# Altium project DSPpanel_v2.PrjPcb
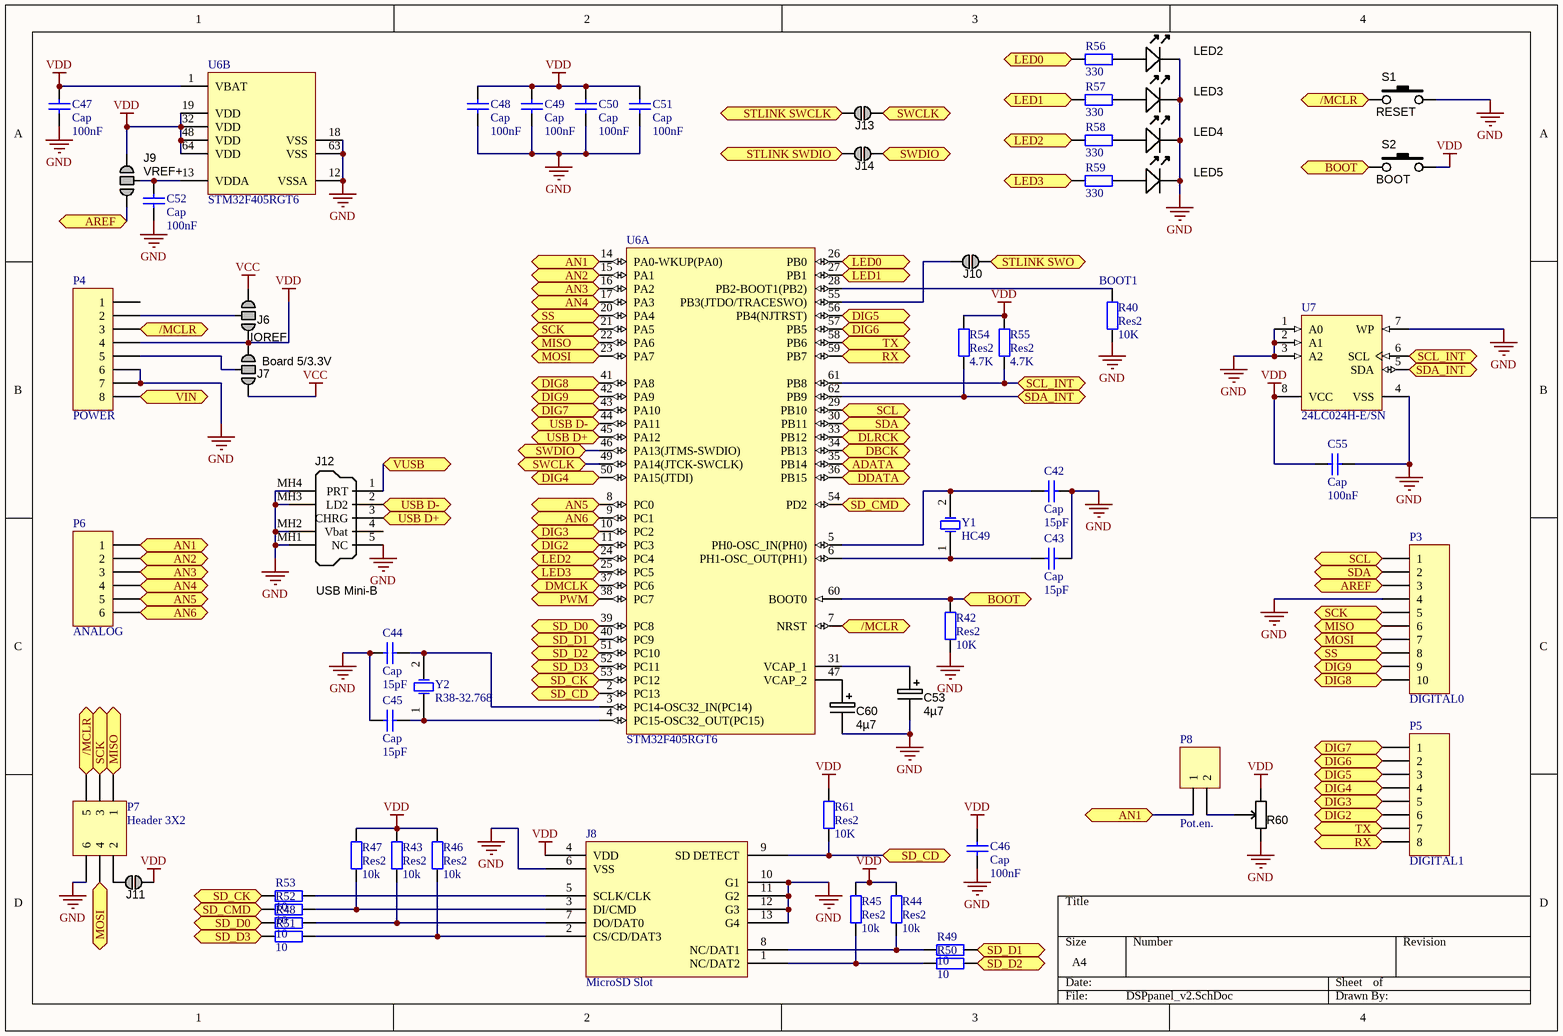
[diagram p0: DSPpanel_v2.SchDoc]
4 sheets, 189 parts. Net scope: flat (ports and power ports of the same name join across sheets).
Board files: DSPpanel_v2.PcbDoc, semlogo.PcbDoc
Sheets:
  DSPpanel_v2.SchDoc
  audioCodec.SchDoc
  tapegyseg.SchDoc
  stlink.SchDoc

## Sheet DSPpanel_v2.SchDoc
size A4

### Parts
C42  Cap  value 15pF  [CAPC2012X135N]
C43  Cap  value 15pF  [CAPC2012X135N]
C44  Cap  value 15pF  [CAPC2012X135N]
C45  Cap  value 15pF  [CAPC2012X135N]
C46  Cap  value 100nF  [CAPC2012X135N]
C47  Cap  value 100nF  [CAPC2012X135N]
C48  Cap  value 100nF  [CAPC2012X135N]
C49  Cap  value 100nF  [CAPC2012X135N]
C50  Cap  value 100nF  [CAPC2012X135N]
C51  Cap  value 100nF  [CAPC2012X135N]
C52  Cap  value 100nF  [CAPC2012X135N]
C53  4µ7  [CAPMP3216X180N]
C55  Cap  value 100nF  [CAPC2012X135N]
C60  4µ7  [CAPMP3216X180N]
J6  IOREF  [Jump_3Way]  (no BOM)
J7  Board 5/3.3V  [Jump_3Way]  (no BOM)
J8  MicroSD Slot  [MICROSD Slot]
J9  VREF+  [Jump_3Way]  (no BOM)
J10  Jumper  [JUMP1]  (value not drawn)  (no BOM)
J11  Jumper  [JUMP1]  (value not drawn)  (no BOM)
J12  USB Mini-B  [USB_Mini-B_Molex_SMT]
J13  Jumper  [JUMP1]  (value not drawn)  (no BOM)
J14  Jumper  [JUMP1]  (value not drawn)  (no BOM)
LED2  B0  [LED-0805-K]  (value not drawn)
LED3  B1  [LED-0805-K]  (value not drawn)
LED4  C4  [LED-0805-K]  (value not drawn)
LED5  C5  [LED-0805-K]  (value not drawn)
P3  DIGITAL0  [HDR1X10]
P4  POWER  [HDR1X8]
P5  DIGITAL1  [HDR1X8]
P6  ANALOG  [HDR1X6]
P7  Header 3X2  [HDR2X3]
P8  Pot.en.  [HDR1X2]
R40  Res2  value 10K  [RESC2012X70N]
R42  Res2  value 10K  [RESC2012X70N]
R43  Res2  value 10k  [RESC2012X70N]
R44  Res2  value 10k  [RESC2012X70N]
R45  Res2  value 10k  [RESC2012X70N]
R46  Res2  value 10k  [RESC2012X70N]
R47  Res2  value 10k  [RESC2012X70N]
R48  value 10  [RESC2012X70N]  (hidden comment: Res2)
R49  value 10  [RESC2012X70N]  (hidden comment: Res2)
R50  value 10  [RESC2012X70N]  (hidden comment: Res2)
R51  value 10  [RESC2012X70N]  (hidden comment: Res2)
R52  value 10  [RESC2012X70N]  (hidden comment: Res2)
R53  value 10  [RESC2012X70N]  (hidden comment: Res2)
R54  Res2  value 4.7K  [RESC2012X70N]
R55  Res2  value 4.7K  [RESC2012X70N]
R56  value 330  [RESC2012X70N]  (hidden comment: Res2)
R57  value 330  [RESC2012X70N]  (hidden comment: Res2)
R58  value 330  [RESC2012X70N]  (hidden comment: Res2)
R59  value 330  [RESC2012X70N]  (hidden comment: Res2)
R60  25 turns  [PT-105]  (value not drawn)
R61  Res2  value 10K  [RESC2012X70N]
S1  RESET  [TACT6x3]
S2  BOOT  [TACT6x3]
U6  STM32F405RGT6  [STM-LQFP64_M]  (parts A,B of 2)
U7  24LC024H-E/SN  [SOIC-SN8_M]
Y1  HC49  [HC49/4H_SMX]
Y2  R38-32.768  [R38]

### Ports
/MCLR, ADATA (out), AN1, AN2, AN3, AN4, AN5, AN6, AREF, BOOT, DBCK (bidir), DDATA (in), DIG2, DIG3, DIG4, DIG5, DIG6, DIG7, DIG8, DIG9, DLRCK (bidir), DMCLK (bidir), LED0, LED1, LED2, LED3, MISO, MOSI, PWM, RX, SCK, SCL, SCL_INT (bidir), SD_CD, SD_CK, SD_CMD, SD_D0, SD_D1, SD_D2, SD_D3, SDA, SDA_INT (bidir), SS, STLINK SWCLK (bidir), STLINK SWDIO (bidir), STLINK SWO (bidir), SWCLK (bidir), SWDIO (bidir), TX, USB D+ (bidir), USB D- (bidir), VIN, VUSB

### Nets
GND: C42.2 C43.2 C44.1 C45.1 C46.1 C47.1 C48.1 C49.1 C50.1 C51.1 C52.1 C53.2 C55.1 C60.2 J8.6(VSS) J8.10(G1) J8.11(G2) J8.12(G3) J8.13(G4) J12.5(NC) J12.MH1(Shell) J12.MH2(Shell) J12.MH3(Shell) J12.MH4(Shell) LED2.K LED3.K LED4.K LED5.K P3.4 P4.6 P4.7 P7.6 R40.1 R42.1 R60.3 S1.2 U6.12(VSSA) U6.18(VSS) U6.63(VSS) U7.1(A0) U7.2(A1) U7.3(A2) U7.4(VSS) U7.7(WP)
VCC: J6.1 J7.3
VDD: C46.2 C47.2 C48.2 C49.2 C50.2 C51.2 C55.2 J6.3 J7.1 J8.4(VDD) J9.3 J11.1 P4.4 R43.2 R44.2 R45.2 R46.2 R47.2 R54.2 R55.2 R60.1 R61.2 S2.2 U6.1(VBAT) U6.19(VDD) U6.32(VDD) U6.48(VDD) U6.64(VDD) U7.8(VCC)
NetC36_1: P4.8 ; port VIN
NetC42_1: C42.1 U6.5(PH0-OSC_IN(PH0)) Y1.2(OSC2)
NetC43_1: C43.1 U6.6(PH1-OSC_OUT(PH1)) Y1.1(OSC1)
NetC44_2: C44.2 U6.3(PC14-OSC32_IN(PC14)) Y2.2(OSC2)
NetC45_2: C45.2 U6.4(PC15-OSC32_OUT(PC15)) Y2.1(OSC1)
NetC52_2: C52.2 J9.2 U6.13(VDDA)
NetC53_1: C53.1 U6.31(VCAP_1)
NetC60_1: C60.1 U6.47(VCAP_2)
NetD1_A: U6.38(PC7) ; port PWM
NetF1_1: J12.1(PRT) ; port VUSB
NetJ6_2: J6.2 P4.2
NetJ7_2: J7.2 P4.5
NetJ8_1: J8.1(NC/DAT2) R45.1 R50.1
NetJ8_2: J8.2(CS/CD/DAT3) R46.1 R51.1
NetJ8_3: J8.3(DI/CMD) R47.1 R52.1
NetJ8_5: J8.5(SCLK/CLK) R53.1
NetJ8_7: J8.7(DO/DAT0) R43.1 R48.1
NetJ8_8: J8.8(NC/DAT1) R44.1 R49.1
NetJ8_9: J8.9(SD_DETECT) R61.1 U6.2(PC13) ; port SD_CD
NetJ9_1: J9.1 P3.3 ; port AREF
NetJ10_1: J10.1 ; port STLINK SWO
NetJ10_2: J10.2 U6.55(PB3(JTDO/TRACESWO))
NetJ11_2: J11.2 P7.2
NetJ12_2: J12.2(LD2) U6.44(PA11) ; port USB D-
NetJ12_3: J12.3(CHRG) U6.45(PA12) ; port USB D+
NetJ13_1: J13.1 U6.49(PA14(JTCK-SWCLK)) ; port SWCLK
NetJ13_2: J13.2 ; port STLINK SWCLK
NetJ14_1: J14.1 U6.46(PA13(JTMS-SWDIO)) ; port SWDIO
NetJ14_2: J14.2 ; port STLINK SWDIO
NetLED2_A: LED2.A R56.1
NetLED3_A: LED3.A R57.1
NetLED4_A: LED4.A R58.1
NetLED5_A: LED5.A R59.1
NetP3_1: P3.1 U6.29(PB10) ; port SCL
NetP3_2: P3.2 U6.30(PB11) ; port SDA
NetP3_5: P3.5 P7.3 U6.21(PA5) ; port SCK
NetP3_6: P3.6 P7.1 U6.22(PA6) ; port MISO
NetP3_7: P3.7 P7.4 U6.23(PA7) ; port MOSI
NetP3_8: P3.8 U6.20(PA4) ; port SS
NetP3_9: P3.9 U6.42(PA9) ; port DIG9
NetP3_10: P3.10 U6.41(PA8) ; port DIG8
NetP4_3: P4.3 P7.5 S1.1 U6.7(NRST) ; port /MCLR
NetP5_1: P5.1 U6.43(PA10) ; port DIG7
NetP5_2: P5.2 U6.57(PB5) ; port DIG6
NetP5_3: P5.3 U6.56(PB4(NJTRST)) ; port DIG5
NetP5_4: P5.4 U6.50(PA15(JTDI)) ; port DIG4
NetP5_5: P5.5 U6.10(PC2) ; port DIG3
NetP5_6: P5.6 U6.11(PC3) ; port DIG2
NetP5_7: P5.7 U6.58(PB6) ; port TX
NetP5_8: P5.8 U6.59(PB7) ; port RX
NetP6_1: P6.1 P8.1 U6.14(PA0-WKUP(PA0)) ; port AN1
NetP6_2: P6.2 U6.15(PA1) ; port AN2
NetP6_3: P6.3 U6.16(PA2) ; port AN3
NetP6_4: P6.4 U6.17(PA3) ; port AN4
NetP6_5: P6.5 U6.8(PC0) ; port AN5
NetP6_6: P6.6 U6.9(PC1) ; port AN6
NetP8_2: P8.2 R60.2
NetR40_2: R40.2 U6.28(PB2-BOOT1(PB2))
NetR42_2: R42.2 S2.1 U6.60(BOOT0) ; port BOOT
NetR48_2: R48.2 U6.39(PC8) ; port SD_D0
NetR49_2: R49.2 U6.40(PC9) ; port SD_D1
NetR50_2: R50.2 U6.51(PC10) ; port SD_D2
NetR51_2: R51.2 U6.52(PC11) ; port SD_D3
NetR52_2: R52.2 U6.54(PD2) ; port SD_CMD
NetR53_2: R53.2 U6.53(PC12) ; port SD_CK
NetR54_1: R54.1 U6.62(PB9) U7.5(SDA) ; port SDA_INT
NetR55_1: R55.1 U6.61(PB8) U7.6(SCL) ; port SCL_INT
NetR56_2: R56.2 U6.26(PB0) ; port LED0
NetR57_2: R57.2 U6.27(PB1) ; port LED1
NetR58_2: R58.2 U6.24(PC4) ; port LED2
NetR59_2: R59.2 U6.25(PC5) ; port LED3
NetU1_5: U6.33(PB12) ; port DLRCK
NetU1_6: U6.34(PB13) ; port DBCK
NetU1_7: U6.37(PC6) ; port DMCLK
NetU1_8: U6.35(PB14) ; port ADATA
NetU1_12: U6.36(PB15) ; port DDATA

Not connected (* = marked no-connect by the designer): J12 4(Vbat); P4 1

### Notes on the sheet
- (near R40) BOOT1

### Library data of the parts
C42-C52 C55 = Cap: Capacitor; Published: 8-Jun-2000; LatestRevisionDate: 17-Jul-2002; LatestRevisionNote: Re-released for DXP Platform.; PackageReference: RAD-0.3; Publisher: Altium Limited; PackageDescription: Radial Cap, Thru-Hole; 2 Leads; 0.3 in Pin Spacing
C53 C60 = CAPT_4u7_3216_16V: Capacitor SMD Tantalum 4.7uF 10% 16V 3216-18; Manufacturer 1: Vishay/Sprague; Manufacturer Part Number 1: 293D475X9016A2TE3; SCDType: undef; Package / Case: EIA 535BAAC size A; Ratings: 16V; Tolerance: ±10%; Material: Tantalum; Supplier 1: Digi-Key; Supplier Part Number 1: 718-1148-1-ND; Value: 4µ7
J6 J7 J9 = JUMP_3WAY: SMD jumper
J10 J11 J13 J14 = JUMP1: SMD jumper
J12 = USB_Mini-B: Connector SMD USB Type Mini-B; Manufacturer 1: Molex Connector Corporation; Manufacturer Part Number 1: 67503-1020; SCDType: undef; Package / Case: SMD; Supplier 1: Digi-Key; Supplier Part Number 1: WM5461CT-ND
LED2-LED5 = LED_SMD_Red_0805_6mcd: LED 0805 SMD Red 6mcd 621nm; Manufacturer 1: Lite-On Inc; Manufacturer Part Number 1: LTST-C171EKT; Material: GaAsP on GaP; Ratings: 6 mcd; 621 nm; SCDType: source; Package / Case: 0805; Supplier 1: Digi-Key; Supplier Part Number 1: 160-1422-1-ND; Value: Red; Color: Red
P3 = Header 10: Header, 10-Pin; LatestRevisionDate: 17-Jul-2002; LatestRevisionNote: Re-released for DXP Platform.; Publisher: Altium Limited
P4 P5 = Header 8: Header, 8-Pin; LatestRevisionDate: 17-Jul-2002; LatestRevisionNote: Re-released for DXP Platform.; Publisher: Altium Limited
P6 = Header 6: Header, 6-Pin; LatestRevisionDate: 17-Jul-2002; LatestRevisionNote: Re-released for DXP Platform.; Publisher: Altium Limited
P7 = Header 3X2: Header, 3-Pin, Dual row; LatestRevisionDate: 17-Jul-2002; LatestRevisionNote: Re-released for DXP Platform.; Publisher: Altium Limited
P8 = Header 2: Header, 2-Pin; LatestRevisionDate: 17-Jul-2002; LatestRevisionNote: Re-released for DXP Platform.; Publisher: Altium Limited
R40 R42-R59 R61 = Res2: Resistor; Published: 8-Jun-2000; LatestRevisionDate: 17-Jul-2002; LatestRevisionNote: Re-released for DXP Platform.; PackageReference: AXIAL-0.4; Publisher: Altium Limited; PackageDescription: Axial Device, Thru-Hole; 2 Leads; 0.4 in Pin Spacing
R60 = POT: Trimmer THD; Tolerance: ±10%; Ratings: 1/2W; ±100ppm/°C; SCDType: spec; Material: Cermet; Package / Case: 10.9mm L x 5.0mm W x 10.0mm H
S1 S2 = SW_THT_PB_5.0mm: Switch, tact, 5.0mm stem; Manufacturer 1: Wealth Metal; Manufacturer Part Number 1: TC-37XB; Function: On/Off; SCDType: spec; Package / Case: 6.5x6.5mm; 5.0mm stem; Material: Brass/Nylon/Ag plating
U6 = STM32F405RGT6: ARM Cortex-M4 32-bit MCU+FPU, 210 DMIPS, 1024 kB Flash, 192 kB Internal RAM, 51 I/Os, 64-pin LQFP, -40 to 85 degC, Tray; Manufacturer: STMicroelectronics; D/A Converter: 2x12-bit; FLASH Size (Prog) (kB): 1024; I/Os (High Current): 51; Internal RAM Size (kB): 192; Operating Frequency(F) (Processor speed) (MHz): 168; Supply Voltage(Vcc) max (V): 3.6; Supply Voltage(Vcc) min (V): 1.8; DatasheetVersion: Rev. 4; PackageVersion: Rev. 4, 06/2013; PackageReference: LQFP64; PackageDescription: 64-Pin Low Profile Quad Flat Package, 10 x 10 mm Body, 0.5 mm Pitch; Supplier 1: Digi-Key; Supplier Part Number 1: 497-11767-ND; Supplier 2: Farnell; Supplier Part Number 2: 2064363; Supplier 3: Newark; Supplier Part Number 3: 73T2329; Supplier 4: Mouser; Supplier Part Number 4: 511-STM32F405RGT6; Core: ARM Cortex-M4; Packing: Tray; Mounting Technology: Surface Mount; PartNumber: STM32F405RGT6; ComponentLink1Description: Manufacturer URL; ComponentLink1URL: http://www.st.com/web/en/home.html; ComponentLink2Description: Datasheet; ComponentLink2URL: http://www.st.com/st-web-ui/static/active/en/resource/technical/document/datasheet/DM00037051.pdf; ComponentLink3Description: Package Specification; ComponentLink3URL: http://www.st.com/st-web-ui/static/active/en/resource/technical/document/datasheet/DM00037051.pdf
U7 = 24LC024H-E/SN: 2Kbit, 1MHz, 2.5V, Addressable Serial EEPROM, 8-Pin SOIC 150mil, Extended Temperature; Manufacturer: Microchip; DatasheetVersion: revA, Aug-2008; PackageVersion: revBB, Aug-2009; PackageReference: SOIC-SN8; PackageDescription: 8-Lead Plastic Small Outline (SN) - Narrow, 3.90mm Body [SOIC]; Supplier 1: Digi-Key; Supplier Part Number 1: 24LC024H-E/SN-ND; Supplier 2: Mouser; Supplier Part Number 2: 579-24LC024H-E/SN; Mounting Technology: Surface Mount; Code_JEDEC: MS-012; Code_IPC: SOIC127P600-8; PartNumber: 24LC024H-E/SN; ComponentLink1Description: Manufacturer URL; ComponentLink1URL: http://www.microchip.com/; ComponentLink2Description: Datasheet; ComponentLink2URL: http://ww1.microchip.com/downloads/en/DeviceDoc/22102A.pdf; ComponentLink3Description: Package Specification; ComponentLink3URL: http://www.microchip.com/stellent/groups/techpub_sg/documents/packagingspec/en012702.pdf
Y1 = HC49/4H_SMX: Surface Mount Quartz Crystal; Note: PCB layout complies with manufacturer's recommendation.; Published: 17-Jul-2002; DatasheetDocument: 18-Oct-1999; PackageDocument: 18-Oct-1999; PackageReference: HC49/4H_SMX; Publisher: Altium Limited; ComponentLink1Description: Manufacturer Link; ComponentLink1URL: http://www.cmac.com/mt/; ComponentLink2Description: Datasheet; ComponentLink2URL: http://www.cmac.com/mt/databook/crystals/smd/hc49_4h_smx.pdf
Y2 = R38-32.768: Tuning Fork Crystal Unit; Published: 8-Jun-2000; LatestRevisionDate: 17-Jul-2002; LatestRevisionNote: Re-released for DXP Platform.; DatasheetDocument: 28-Sep-1998; PackageReference: R38; Publisher: Altium Limited; ComponentLink1Description: Manufacturer Link; ComponentLink1URL: http://www.raltron.com/products/microcrystals/default.asp; ComponentLink2Description: Datasheet; ComponentLink2URL: http://www.raltron.com/products/pdfspecs/crystal_r38_26_145.pdf

## Sheet audioCodec.SchDoc
size A4
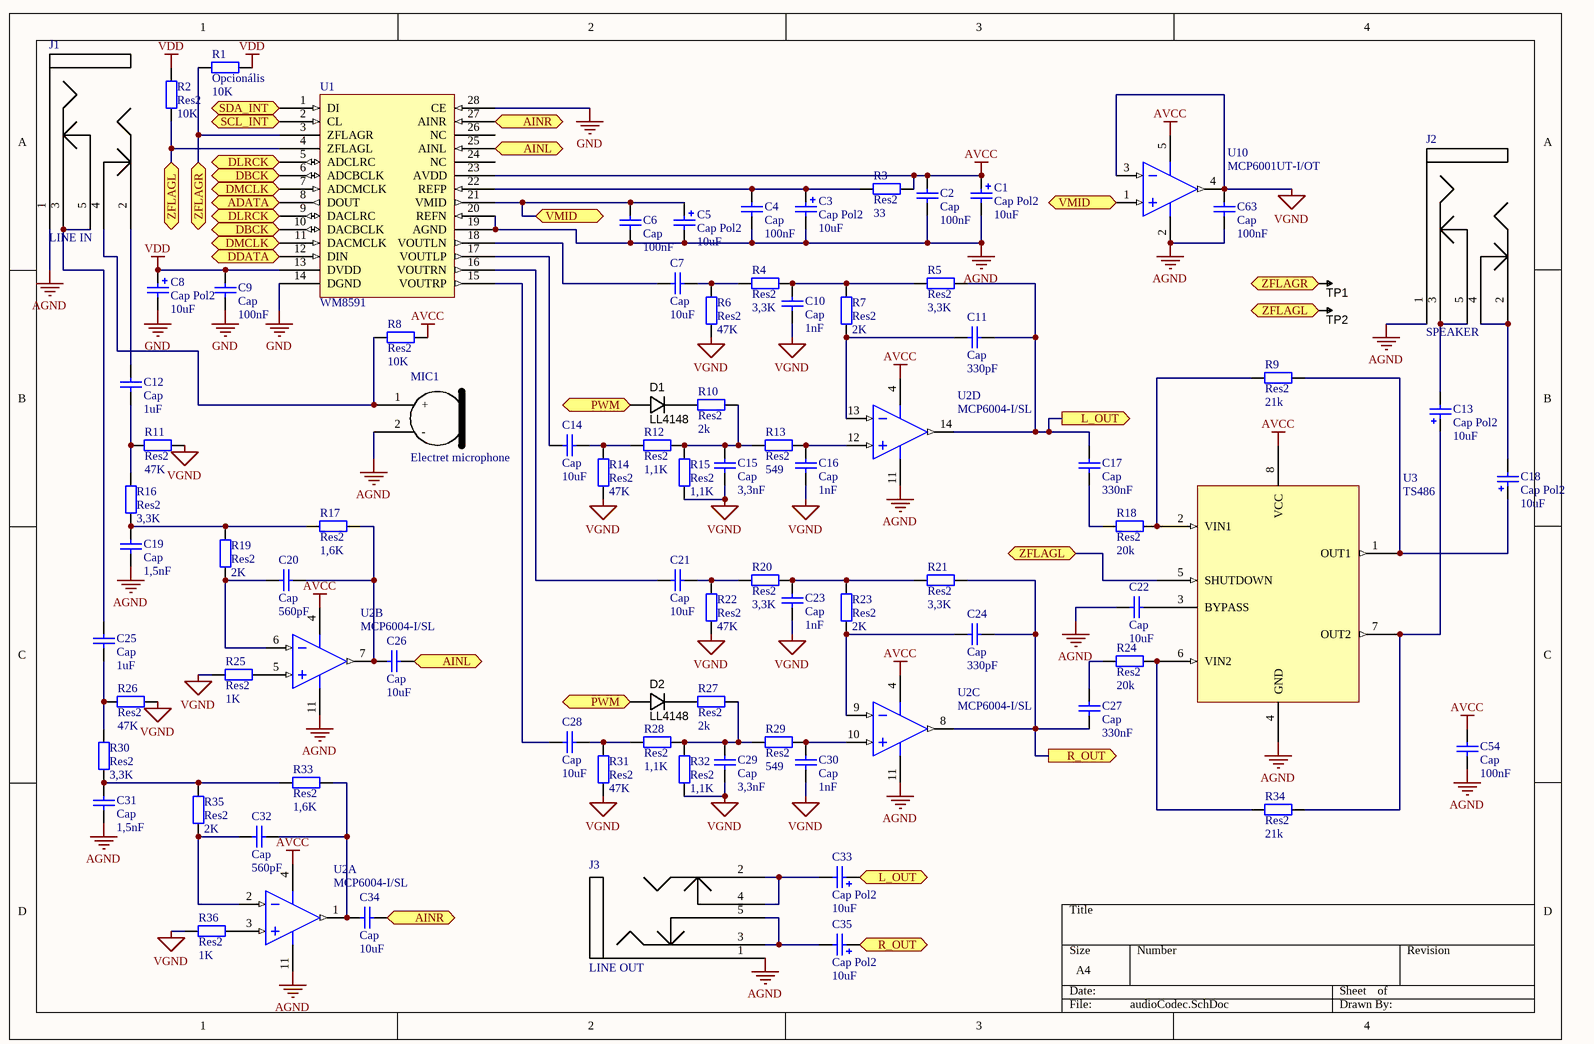
[diagram p1: audioCodec.SchDoc]

### Parts
C1  Cap Pol2  value 10uF  [CAPMP3528X210N]
C2  Cap  value 100nF  [CAPC2012X135N]
C3  Cap Pol2  value 10uF  [CAPMP3528X210N]
C4  Cap  value 100nF  [CAPC2012X135N]
C5  Cap Pol2  value 10uF  [CAPMP3528X210N]
C6  Cap  value 100nF  [CAPC2012X135N]
C7  Cap  value 10uF  [CAPC2012X135N]
C8  Cap Pol2  value 10uF  [CAPMP3528X210N]
C9  Cap  value 100nF  [CAPC2012X135N]
C10  Cap  value 1nF  [CAPC2012X135N]
C11  Cap  value 330pF  [CAPC2012X135N]
C12  Cap  value 1uF  [CAPC2012X135N]
C13  Cap Pol2  value 10uF  [CAPMP3528X210N]
C14  Cap  value 10uF  [CAPC2012X135N]
C15  Cap  value 3,3nF  [CAPC2012X135N]
C16  Cap  value 1nF  [CAPC2012X135N]
C17  Cap  value 330nF  [CAPC2012X135N]
C18  Cap Pol2  value 10uF  [CAPMP3528X210N]
C19  Cap  value 1,5nF  [CAPC2012X135N]
C20  Cap  value 560pF  [CAPC2012X135N]
C21  Cap  value 10uF  [CAPC2012X135N]
C22  Cap  value 10uF  [CAPC2012X135N]
C23  Cap  value 1nF  [CAPC2012X135N]
C24  Cap  value 330pF  [CAPC2012X135N]
C25  Cap  value 1uF  [CAPC2012X135N]
C26  Cap  value 10uF  [CAPC2012X135N]
C27  Cap  value 330nF  [CAPC2012X135N]
C28  Cap  value 10uF  [CAPC2012X135N]
C29  Cap  value 3,3nF  [CAPC2012X135N]
C30  Cap  value 1nF  [CAPC2012X135N]
C31  Cap  value 1,5nF  [CAPC2012X135N]
C32  Cap  value 560pF  [CAPC2012X135N]
C33  Cap Pol2  value 10uF  [CAPMP3528X210N]
C34  Cap  value 10uF  [CAPC2012X135N]
C35  Cap Pol2  value 10uF  [CAPMP3528X210N]
C54  Cap  value 100nF  [CAPC2012X135N]
C63  Cap  value 100nF  [CAPC2012X135N]
D1  Manufacturer Part Number 1: LL4148  [SOD80, LL-34]  (hidden comment: Mini MELF)
D2  Manufacturer Part Number 1: LL4148  [SOD80, LL-34]  (hidden comment: Mini MELF)
J1  LINE IN  [STEREO JACK 3.5 mm]
J2  SPEAKER  [STEREO JACK 3.5 mm]
J3  LINE OUT  [STEREO JACK 3.5 mm]
MIC1  Electret microphone  [MIC 10 mm]
R1  Opcionális  value 10K  [RESC2012X70N]
R2  Res2  value 10K  [RESC2012X70N]
R3  Res2  value 33  [RESC2012X70N]
R4  Res2  value 3,3K  [RESC2012X70N]
R5  Res2  value 3,3K  [RESC2012X70N]
R6  Res2  value 47K  [RESC2012X70N]
R7  Res2  value 2K  [RESC2012X70N]
R8  Res2  value 10K  [RESC2012X70N]
R9  Res2  value 21k  [RESC2012X70N]
R10  Res2  value 2k  [RESC2012X70N]
R11  Res2  value 47K  [RESC2012X70N]
R12  Res2  value 1,1K  [RESC2012X70N]
R13  Res2  value 549  [RESC2012X70N]
R14  Res2  value 47K  [RESC2012X70N]
R15  Res2  value 1,1K  [RESC2012X70N]
R16  Res2  value 3,3K  [RESC2012X70N]
R17  Res2  value 1,6K  [RESC2012X70N]
R18  Res2  value 20k  [RESC2012X70N]
R19  Res2  value 2K  [RESC2012X70N]
R20  Res2  value 3,3K  [RESC2012X70N]
R21  Res2  value 3,3K  [RESC2012X70N]
R22  Res2  value 47K  [RESC2012X70N]
R23  Res2  value 2K  [RESC2012X70N]
R24  Res2  value 20k  [RESC2012X70N]
R25  Res2  value 1K  [RESC2012X70N]
R26  Res2  value 47K  [RESC2012X70N]
R27  Res2  value 2k  [RESC2012X70N]
R28  Res2  value 1,1K  [RESC2012X70N]
R29  Res2  value 549  [RESC2012X70N]
R30  Res2  value 3,3K  [RESC2012X70N]
R31  Res2  value 47K  [RESC2012X70N]
R32  Res2  value 1,1K  [RESC2012X70N]
R33  Res2  value 1,6K  [RESC2012X70N]
R34  Res2  value 21k  [RESC2012X70N]
R35  Res2  value 2K  [RESC2012X70N]
R36  Res2  value 1K  [RESC2012X70N]
TP1  TESTPOINT  [TP-R60]  (value not drawn)  (no BOM)
TP2  TESTPOINT  [TP-R60]  (value not drawn)  (no BOM)
U1  WM8591  [SSOP-28]
U2  MCP6004-I/SL  [SOIC-SL14_N]  (parts A,B,C,D of 4)
U3  TS486  [MSOP-MS8_M]
U10  MCP6001UT-I/OT  [SOT-23-OT5_M]

### Ports
ADATA (out), AINL (in), AINL (out), AINR (in), AINR (out), DBCK (bidir), DDATA (in), DLRCK (bidir), DMCLK (bidir), L_OUT (in), L_OUT (out), PWM, R_OUT (in), R_OUT (out), SCL_INT (bidir), SDA_INT (bidir), VMID, ZFLAGL (bidir), ZFLAGR (bidir)

### Nets
AGND: C1.2 C2.2 C3.2 C4.2 C5.2 C6.2 C19.2 C22.2 C31.2 C54.2 C63.2 J1.1 J2.1 J3.1 MIC1.2(-) U1.19(AGND) U1.20(REFN) U2.11(VSS) U3.4(GND) U10.2(VSS)
AVCC: C1.1 C2.1 C54.1 R3.1 R8.2 U1.23(AVDD) U2.4(VDD) U3.8(VCC) U10.5(VDD)
GND: C8.2 C9.2 U1.14(DGND) U1.28(CE)
VDD: C8.1 C9.1 R1.1 R2.1 U1.13(DVDD)
VGND: C10.2 C15.2 C16.2 C23.2 C29.2 C30.2 C63.1 R6.1 R11.2 R14.1 R15.2 R22.1 R25.2 R26.2 R31.1 R32.2 R36.2 U10.3(VIN-) U10.4(VOUT)
NetC3_1: C3.1 C4.1 R3.2 U1.22(REFP)
NetC5_1: C5.1 C6.1 U1.21(VMID) U10.1(VIN+) ; port VMID
NetC7_1: C7.1 R4.2 R6.2
NetC7_2: C7.2 U1.18(VOUTLN)
NetC10_1: C10.1 R4.1 R5.2 R7.2
NetC11_1: C11.1 R7.1 U2.13(VIND-)
NetC11_2: C11.2 C17.1 C33.1 R5.1 U2.14(VOUTD) ; port L_OUT
NetC12_1: C12.1 J1.2
NetC12_2: C12.2 R11.1 R16.1
NetC13_1: C13.1 R34.1 U3.7(OUT2)
NetC13_2: C13.2 J2.3 J2.5
NetC14_1: C14.1 R12.2 R14.2
NetC14_2: C14.2 U1.17(VOUTLP)
NetC15_1: C15.1 R10.1 R12.1 R13.2 R15.1
NetC16_1: C16.1 R13.1 U2.12(VIND+)
NetC17_2: C17.2 R18.2
NetC18_1: C18.1 R9.1 U3.1(OUT1)
NetC18_2: C18.2 J2.2 J2.4
NetC19_1: C19.1 R16.2 R17.2 R19.2
NetC20_1: C20.1 C26.2 R17.1 U2.7(VOUTB)
NetC20_2: C20.2 R19.1 U2.6(VINB-)
NetC21_1: C21.1 R20.2 R22.2
NetC21_2: C21.2 U1.16(VOUTRN)
NetC22_1: C22.1 U3.3(BYPASS)
NetC23_1: C23.1 R20.1 R21.2 R23.2
NetC24_1: C24.1 R23.1 U2.9(VINC-)
NetC24_2: C24.2 C27.2 C35.1 R21.1 U2.8(VOUTC) ; port R_OUT
NetC25_1: C25.1 J1.3 J1.5
NetC25_2: C25.2 R26.1 R30.1
NetC26_1: C26.1 U1.25(AINL) ; port AINL
NetC27_1: C27.1 R24.2
NetC28_1: C28.1 R28.2 R31.2
NetC28_2: C28.2 U1.15(VOUTRP)
NetC29_1: C29.1 R27.2 R28.1 R29.2 R32.1
NetC30_1: C30.1 R29.1 U2.10(VINC+)
NetC31_1: C31.1 R30.2 R33.2 R35.2
NetC32_1: C32.1 C34.2 R33.1 U2.1(VOUTA)
NetC32_2: C32.2 R35.1 U2.2(VINA-)
NetC33_2: C33.2 J3.2 J3.4
NetC34_1: C34.1 U1.27(AINR) ; port AINR
NetC35_2: C35.2 J3.3 J3.5
NetD1_A: D1.A D2.A ; port PWM
NetD1_K: D1.K R10.2
NetD2_K: D2.K R27.1
NetJ1_4: J1.4 MIC1.1(+) R8.1
NetR1_2: R1.2 TP1.1 U1.3(ZFLAGR) ; port ZFLAGR
NetR2_2: R2.2 TP2.1 U1.4(ZFLAGL) U3.5(SHUTDOWN) ; port ZFLAGL
NetR9_2: R9.2 R18.1 U3.2(VIN1)
NetR24_1: R24.1 R34.2 U3.6(VIN2)
NetR25_1: R25.1 U2.5(VINB+)
NetR36_1: R36.1 U2.3(VINA+)
NetR54_1: U1.1(DI) ; port SDA_INT
NetR55_1: U1.2(CL) ; port SCL_INT
NetU1_5: U1.5(ADCLRC) U1.9(DACLRC) ; port DLRCK
NetU1_6: U1.6(ADCBCLK) U1.10(DACBCLK) ; port DBCK
NetU1_7: U1.7(ADCMCLK) U1.11(DACMCLK) ; port DMCLK
NetU1_8: U1.8(DOUT) ; port ADATA
NetU1_12: U1.12(DIN) ; port DDATA

Not connected (* = marked no-connect by the designer): U1 24(NC) 26(NC)

### Library data of the parts
C1 C3 C5 C8 C13 C18 C33 C35 = Cap Pol2: Polarized Capacitor (Axial); Published: 8-Jun-2000; LatestRevisionDate: 17-Jul-2002; LatestRevisionNote: Re-released for DXP Platform.; PackageReference: POLAR0.8; Publisher: Altium Limited; PackageDescription: Polarized Capacitor; 2 Leads
C2 C4 C6 C7 C9-C12 C14-C17 C19-C32 C34 C54 C63 = Cap: Capacitor; Published: 8-Jun-2000; LatestRevisionDate: 17-Jul-2002; LatestRevisionNote: Re-released for DXP Platform.; PackageReference: RAD-0.3; Publisher: Altium Limited; PackageDescription: Radial Cap, Thru-Hole; 2 Leads; 0.3 in Pin Spacing
D1 D2 = DIODE_100V_500mW_MELF: Diode SMD 100V 150mA 500mW SOD80; Manufacturer 1: Fairchild Semiconductor; Ratings: 100V; 150mA min; 500mW; Material: Si; Diode Type: Standard; Value: Vf=1V @ 10mA; SCDType: source; Package / Case: SOD80, LL-34; Manufacturer 2: DC Components; Manufacturer Part Number 2: DL4148; Supplier 1: Digi-Key; Supplier Part Number 1: LL4148FSCT-ND
J1-J3 = STEREO JACK: Sztereo audio csatlakozó 3,5 mm
MIC1 = Electret microphone: Elektret mikrofon kapszula
R1-R36 = Res2: Resistor; Published: 8-Jun-2000; LatestRevisionDate: 17-Jul-2002; LatestRevisionNote: Re-released for DXP Platform.; PackageReference: AXIAL-0.4; Publisher: Altium Limited; PackageDescription: Axial Device, Thru-Hole; 2 Leads; 0.4 in Pin Spacing
TP1 TP2 = TESTPOINT: SMD test pin
U1 = WM8591: WM8591 AUDIO CODEC
U2 = MCP6004-I/SL: 1 MHz, Low-Power Operational Amplifier, 14-Pin SOIC, Industrial Temperature; Published: 29-Jan-2009; LatestRevisionDate: 02-Dec-2009; LatestRevisionNote: Updated to datasheet revision J, Nov-2009; DatasheetVersion: revJ, Nov-2009; PackageVersion: revBB, Aug-2009; PackageReference: SOIC-SL14; Publisher: Altium Limited; PackageDescription: 14-Lead Plastic Small Outline (SL) - Narrow, 3.90mm Body [SOIC]; Supplier 1: Digi-Key; Supplier Part Number 1: MCP6004-I/SL-ND; Supplier 2: Farnell; Supplier Part Number 2: 6530837; Code_JEDEC: MS-012-AB; Code_IPC: SOIC127P600-14; ComponentLink1Description: Datasheet; ComponentLink1URL: http://ww1.microchip.com/downloads/en/DeviceDoc/21733j.pdf; ComponentLink2Description: Packaging Specification; ComponentLink2URL: http://www.microchip.com/stellent/groups/techpub_sg/documents/packagingspec/en012702.pdf; ComponentLink3Description: Microchip.com Home; ComponentLink3URL: http://www.microchip.com/
U3 = TS486: 0.1 W audio amplifier
U10 = MCP6001UT-I/OT: 1 MHz, Low-Power Operational Amplifier, 5-Pin SOT-23, Industrial Temperature, Tape and Reel; Published: 29-Jan-2009; LatestRevisionDate: 02-Dec-2009; LatestRevisionNote: Updated to datasheet revision J, Nov-2009; DatasheetVersion: revJ, Nov-2009; PackageVersion: revBB, Aug-2009; PackageReference: SOT-23-OT5; Publisher: Altium Limited; PackageDescription: 5-Lead Plastic Small Outline Transistor (OT) [SOT-23]; Supplier 1: Digi-Key; Supplier Part Number 1: MCP6001UT-I/OTTR-ND; Supplier 2: Digi-Key; Supplier Part Number 2: MCP6001UT-I/OTCT-ND; Supplier 3: Digi-Key; Supplier Part Number 3: MCP6001UT-I/OTDKR-ND; Supplier 4: Farnell; Supplier Part Number 4: 8540845; Code_IPC: SOT23-5; ComponentLink1Description: Datasheet; ComponentLink1URL: http://ww1.microchip.com/downloads/en/DeviceDoc/21733j.pdf; ComponentLink2Description: Packaging Specification; ComponentLink2URL: http://www.microchip.com/stellent/groups/techpub_sg/documents/packagingspec/en012702.pdf; ComponentLink3Description: Microchip.com Home; ComponentLink3URL: http://www.microchip.com/

## Sheet tapegyseg.SchDoc
size A4
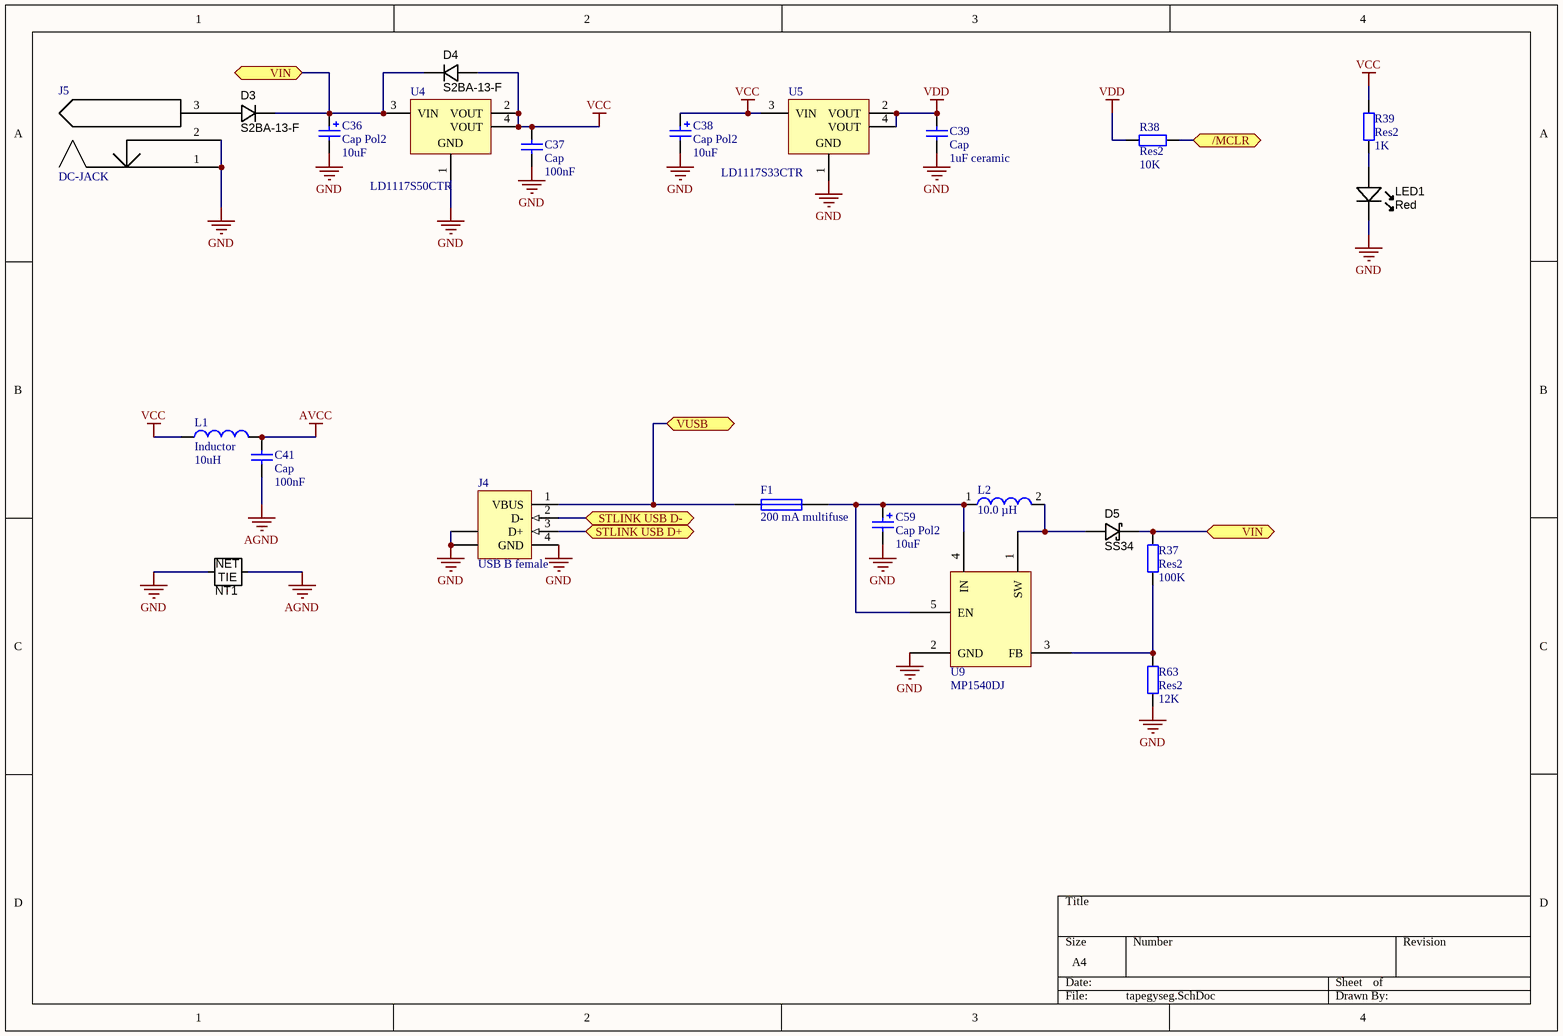
[diagram p2: tapegyseg.SchDoc]

### Parts
C36  Cap Pol2  value 10uF  [CAPMP3528X210N]
C37  Cap  value 100nF  [CAPC2012X135N]
C38  Cap Pol2  value 10uF  [CAPMP3528X210N]
C39  Cap  value 1uF ceramic  [CAPC2012X135N]
C41  Cap  value 100nF  [CAPC2012X135N]
C59  Cap Pol2  value 10uF  [CAPMP3528X210N]
D3  Manufacturer Part Number 1: S2BA-13-F  [DO-214AC]  (hidden comment: 100V; 1.5A)
D4  Manufacturer Part Number 1: S2BA-13-F  [DO-214AC]  (hidden comment: 100V; 1.5A)
D5  SS34  [DO-214AA]
F1  200 mA multifuse  [RESC6332X70N]
J4  USB B female  [1437106]
J5  DC-JACK  [JACK]
L1  Inductor  value 10uH  [6-0805_N]
L2  Inductance: 10.0 µH  [WE-PD2-MS]  (hidden comment: 7447745100)
LED1  Color: Red  [LED-0805-K]
NT1  Net Tie  [NetTie_External_24mil]  (value not drawn)  (net tie, no BOM)
R37  Res2  value 100K  [RESC2012X70N]
R38  Res2  value 10K  [RESC2012X70N]
R39  Res2  value 1K  [RESC2012X70N]
R63  Res2  value 12K  [RESC2012X70N]
U4  LD1117S50CTR  [SOT-223_M]
U5  LD1117S33CTR  [SOT-223_L]
U9  MP1540DJ  [S5]

### Ports
/MCLR, STLINK USB D+ (bidir), STLINK USB D- (bidir), VIN, VUSB

### Nets
AGND: C41.1 NT1.2
AVCC: C41.2 L1.2
GND: C36.2 C37.1 C38.2 C39.1 C59.2 J4.4(GND) J4.5(SHLD) J4.6(SHLD) J5.1 J5.2 LED1.K NT1.1 R63.1 U4.1(GND) U5.1(GND) U9.2(GND)
VCC: C37.2 C38.1 D4.A L1.1 R39.2 U4.2(VOUT) U4.4(VOUT) U5.3(VIN)
VDD: C39.2 R38.1 U5.2(VOUT) U5.4(VOUT)
NetC36_1: C36.1 D3.K D4.K D5.K R37.2 U4.3(VIN) ; port VIN
NetC59_1: C59.1 F1.2 L2.1 U9.4(IN) U9.5(EN)
NetD3_A: D3.A J5.3
NetD5_A: D5.A L2.2 U9.1(SW)
NetF1_1: F1.1 J4.1(VBUS) ; port VUSB
NetJ4_2: J4.2(D-) ; port STLINK USB D-
NetJ4_3: J4.3(D+) ; port STLINK USB D+
NetLED1_A: LED1.A R39.1
NetP4_3: R38.2 ; port /MCLR
NetR37_1: R37.1 R63.2 U9.3(FB)

### Notes on the sheet
- (in symbol JUMP_NETTIE) NET; TIE

### Library data of the parts
C36 C38 C59 = Cap Pol2: Polarized Capacitor (Axial); Published: 8-Jun-2000; LatestRevisionDate: 17-Jul-2002; LatestRevisionNote: Re-released for DXP Platform.; PackageReference: POLAR0.8; Publisher: Altium Limited; PackageDescription: Polarized Capacitor; 2 Leads
C37 C39 C41 = Cap: Capacitor; Published: 8-Jun-2000; LatestRevisionDate: 17-Jul-2002; LatestRevisionNote: Re-released for DXP Platform.; PackageReference: RAD-0.3; Publisher: Altium Limited; PackageDescription: Radial Cap, Thru-Hole; 2 Leads; 0.3 in Pin Spacing
D3 D4 = DIODE_100V_1.5A_SMA: Diode SMD 100V 1.5A SMA; Manufacturer 1: Diodes Inc; Material: Si; Diode Type: Standard; Value: Vf = 1.15V @ 1.5A (Max); SCDType: source; Package / Case: DO-214AC, SMA; Ratings: 100V; 1.5A; Supplier 1: Digi-Key; Supplier Part Number 1: S2BA-FDICT-ND
D5 = DIODE_SCHOTTKY_MBRS130L: Diode Schottky SMD 30V 2A DO-214AA; Manufacturer 1: Fairchild Semiconductor; Material: Si; Ratings: 30Vr; 2A; SCDType: source; Package / Case: DO-214AA, SMB; Supplier 1: Digi-Key; Supplier Part Number 1: MBRS130LFSCT-ND; Manufacturer Part Number 1: MBRS130L
F1 = Fuse 1: Fuse; Published: 8-Jun-2000; LatestRevisionDate: 17-Jul-2002; LatestRevisionNote: Re-released for DXP Platform.; PackageReference: PIN-W2/E2.8; Publisher: Altium Limited; PackageDescription: 1210
J4 = 4-1437106-8: USB 1.1, Right Angle, Thru-Hole, B Type, Receptacle, 4 Position, Natural; ContactMaterial: Copper Alloy; ContactPlating: Gold (30); TerminationLength: 2.90mm [0.114in.]; PCB_Layout: Complies with manufacturer's recommendation.; DrillSize: Corresponds to nominal value.; PanelGround: Without; Published: 15-Jul-2004; DatasheetDocument: 05-Jan-2004; PackageDocument: 05-Jan-2004; PackageReference: 1437106; Publisher: Altium Limited; HousingMaterial: Glass-Filled Thermoplastic; ComponentLink1Description: Manufacturer Link; ComponentLink1URL: http://www.tycoelectronics.com/; ComponentLink2Description: Packaging Specification; ComponentLink2URL: http://ecommas.tycoelectronics.com/commerce/DocumentDelivery/DDEController?Action=showdoc&DocId=Customer+Drawing%7F1437106%7FC%7Ftif%7FEnglish%7FENG_CD_1437106_C.tif
J5 = DC-JACK: Tápcsatlakozó
L1 = Inductor: Code_IEC: 1005; Published: 8-Jun-2000; LatestRevisionDate: 29-May-2009; LatestRevisionNote: IPC-7351 Footprint Added.; PackageReference: 0402-A; Publisher: Altium Limited; PackageDescription: Chip Inductor; Code_JEITA: 0402
L2 = 7447745100: SMD Power Inductor WE-PD2, L = 10.0 µH; DatasheetVersion: ver 2, May-2009; PackageVersion: 2009; PackageReference: WE-PD2-MS; PackageDescription: SMD Inductor, 2-Leads, Body 5.8 x 5.2 mm; ComponentLink1Description: Manufacturer URL; ComponentLink1URL: http://www.we-online.com; ComponentLink2Description: Datasheet; ComponentLink2URL: http://www.we-online.de/katalog/media/pdf/7447745100.pdf
LED1 = LED_SMD_Red_0805_6mcd: as LED2 on sheet DSPpanel_v2; Package / Case: 0805; Supplier 1: Digi-Key; Supplier Part Number 1: 160-1422-1-ND; Value: Red
NT1 = JUMP_NETTIE
R37-R39 R63 = Res2: Resistor; Published: 8-Jun-2000; LatestRevisionDate: 17-Jul-2002; LatestRevisionNote: Re-released for DXP Platform.; PackageReference: AXIAL-0.4; Publisher: Altium Limited; PackageDescription: Axial Device, Thru-Hole; 2 Leads; 0.4 in Pin Spacing
U4 = LD1117S50CTR: Fixed Low Drop Positive Voltage Regulator, 5V, 4-Pin SOT-223, Tape and Reel; DatasheetVersion: Nov-2011; PackageVersion: 2010; PackageReference: SOT-223; PackageDescription: 4-Pin SOT-223 Package, 6.5 x 3.5 mm Body, 2.3 mm Pitch, 7 mm Lead Span; PartNumber: LD1117S50CTR; ComponentLink1Description: Manufacturer URL; ComponentLink1URL: http://www.st.com; ComponentLink2Description: Datasheet; ComponentLink2URL: http://www.st.com/internet/com/TECHNICAL_RESOURCES/TECHNICAL_LITERATURE/DATASHEET/CD00000544.pdf
U5 = LD1117S33CTR: Fixed Low Drop Positive Voltage Regulator, 3.3V, 4-Pin SOT-223, Tape and Reel; DatasheetVersion: Nov-2011; PackageVersion: 2010; PackageReference: SOT-223; PackageDescription: 4-Pin SOT-223 Package, 6.5 x 3.5 mm Body, 2.3 mm Pitch, 7 mm Lead Span; PartNumber: LD1117S33CTR; ComponentLink1Description: Manufacturer URL; ComponentLink1URL: http://www.st.com; ComponentLink2Description: Datasheet; ComponentLink2URL: http://www.st.com/internet/com/TECHNICAL_RESOURCES/TECHNICAL_LITERATURE/DATASHEET/CD00000544.pdf
U9 = MP1540: Step-up converter

## Sheet stlink.SchDoc
size A4
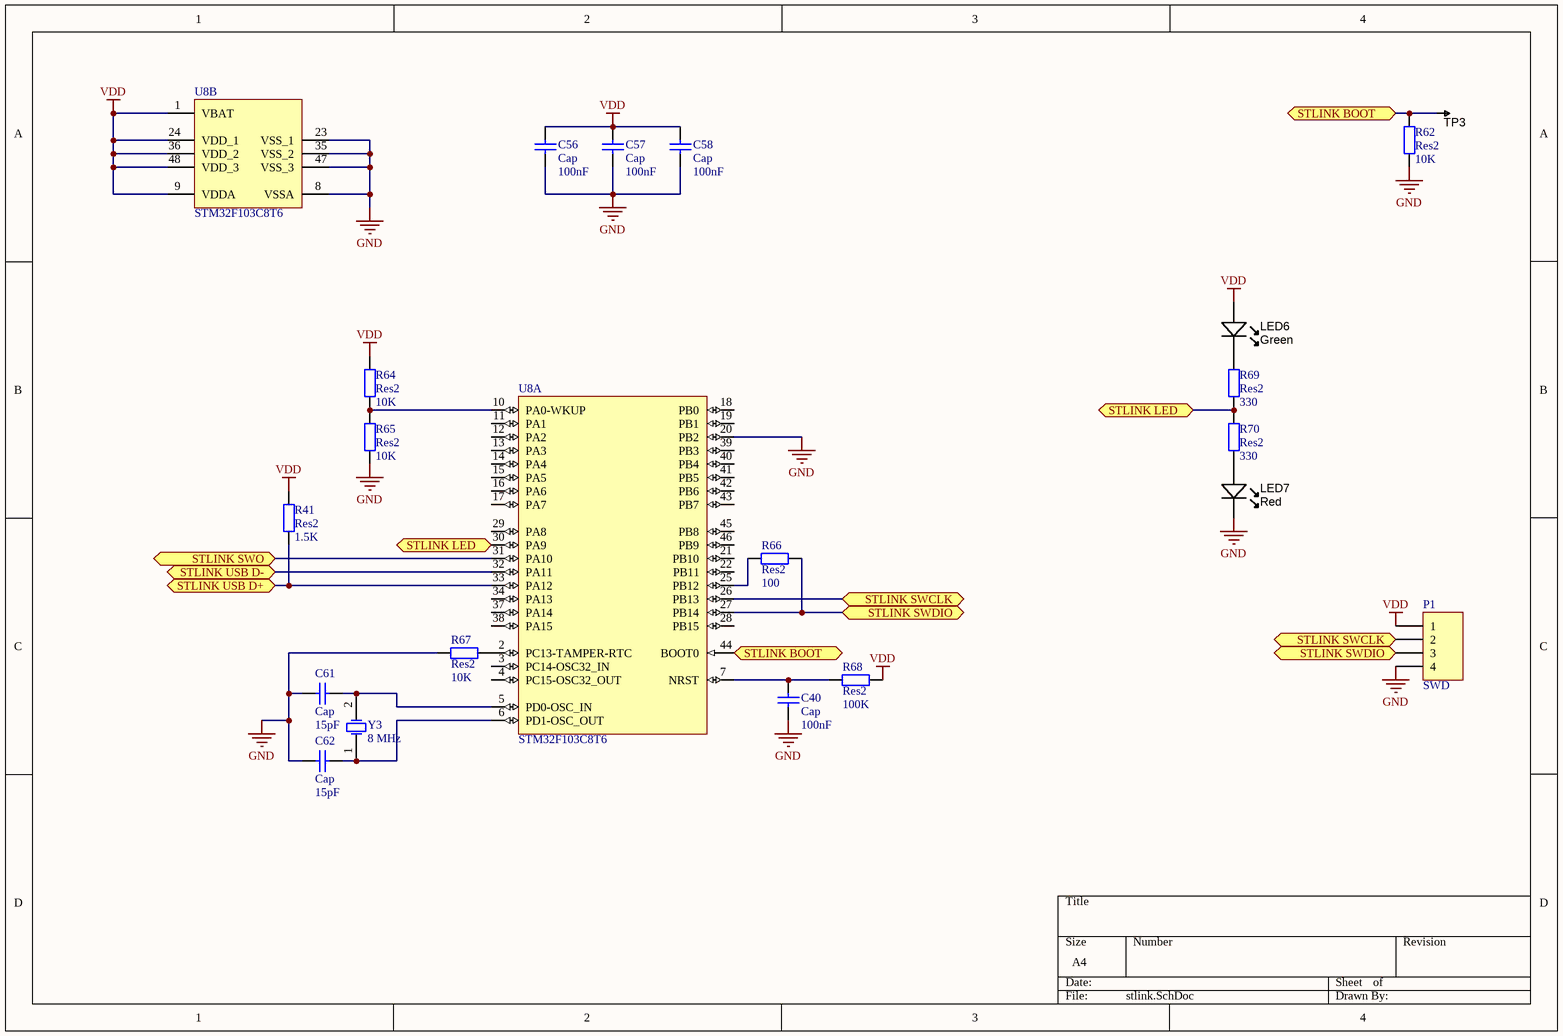
[diagram p3: stlink.SchDoc]

### Parts
C40  Cap  value 100nF  [CAPC2012X135N]
C56  Cap  value 100nF  [CAPC2012X135N]
C57  Cap  value 100nF  [CAPC2012X135N]
C58  Cap  value 100nF  [CAPC2012X135N]
C61  Cap  value 15pF  [CAPC2012X135N]
C62  Cap  value 15pF  [CAPC2012X135N]
LED6  value Green  [LED-0805-K]  (hidden comment: B0)
LED7  value Red  [LED-0805-K]  (hidden comment: B0)
P1  SWD  [HDR1X4]
R41  Res2  value 1.5K  [RESC2012X70N]
R62  Res2  value 10K  [RESC2012X70N]
R64  Res2  value 10K  [RESC2012X70N]
R65  Res2  value 10K  [RESC2012X70N]
R66  Res2  value 100  [RESC2012X70N]
R67  Res2  value 10K  [RESC2012X70N]
R68  Res2  value 100K  [RESC2012X70N]
R69  Res2  value 330  [RESC2012X70N]
R70  Res2  value 330  [RESC2012X70N]
TP3  TESTPOINT  [TP-R60]  (value not drawn)  (no BOM)
U8  STM32F103C8T6  [STM-LQFP48_N]  (parts A,B of 2)
Y3  8 MHz  [HC49/4H_SMX]

### Ports
STLINK BOOT, STLINK LED, STLINK SWCLK (bidir), STLINK SWDIO (bidir), STLINK SWO (bidir), STLINK USB D+ (bidir), STLINK USB D- (bidir)

### Nets
GND: C40.1 C56.1 C57.1 C58.1 C61.2 C62.1 LED7.K P1.4 R62.1 R65.1 R67.2 U8.8(VSSA) U8.20(PB2) U8.23(VSS_1) U8.35(VSS_2) U8.47(VSS_3)
VDD: C56.2 C57.2 C58.2 LED6.A P1.1 R41.2 R64.2 R68.1 U8.1(VBAT) U8.9(VDDA) U8.24(VDD_1) U8.36(VDD_2) U8.48(VDD_3)
NetC40_2: C40.2 R68.2 U8.7(NRST)
NetC61_1: C61.1 U8.5(PD0-OSC_IN) Y3.2(OSC2)
NetC62_2: C62.2 U8.6(PD1-OSC_OUT) Y3.1(OSC1)
NetJ4_2: U8.32(PA11) ; port STLINK USB D-
NetJ4_3: R41.1 U8.33(PA12) ; port STLINK USB D+
NetJ10_1: U8.31(PA10) ; port STLINK SWO
NetJ13_2: P1.2 U8.26(PB13) ; port STLINK SWCLK
NetJ14_2: P1.3 R66.1 U8.27(PB14) ; port STLINK SWDIO
NetLED6_K: LED6.K R69.2
NetLED7_A: LED7.A R70.1
NetR62_2: R62.2 TP3.1 U8.44(BOOT0) ; port STLINK BOOT
NetR64_1: R64.1 R65.2 U8.10(PA0-WKUP)
NetR66_2: R66.2 U8.25(PB12)
NetR67_1: R67.1 U8.2(PC13-TAMPER-RTC)
NetR69_1: R69.1 R70.2 U8.30(PA9) ; port STLINK LED

Not connected (* = marked no-connect by the designer): U8 3(PC14-OSC32_IN) 4(PC15-OSC32_OUT) 11(PA1) 12(PA2) 13(PA3) 14(PA4) 15(PA5) 16(PA6) 17(PA7) 18(PB0) 19(PB1) 21(PB10) 22(PB11) 28(PB15) 29(PA8) 34(PA13) 37(PA14) 38(PA15) 39(PB3) 40(PB4) 41(PB5) 42(PB6) 43(PB7) 45(PB8) 46(PB9)

### Library data of the parts
C40 C56-C58 C61 C62 = Cap: Capacitor; Published: 8-Jun-2000; LatestRevisionDate: 17-Jul-2002; LatestRevisionNote: Re-released for DXP Platform.; PackageReference: RAD-0.3; Publisher: Altium Limited; PackageDescription: Radial Cap, Thru-Hole; 2 Leads; 0.3 in Pin Spacing
LED6 LED7 = LED_SMD_Red_0805_6mcd: as LED2 on sheet DSPpanel_v2; Package / Case: 0805; Supplier 1: Digi-Key; Supplier Part Number 1: 160-1422-1-ND
  LED6: Color: Green
  LED7: Color: Red
P1 = Header 4: Header, 4-Pin; LatestRevisionDate: 17-Jul-2002; LatestRevisionNote: Re-released for DXP Platform.; Publisher: Altium Limited
R41 R62 R64-R70 = Res2: Resistor; Published: 8-Jun-2000; LatestRevisionDate: 17-Jul-2002; LatestRevisionNote: Re-released for DXP Platform.; PackageReference: AXIAL-0.4; Publisher: Altium Limited; PackageDescription: Axial Device, Thru-Hole; 2 Leads; 0.4 in Pin Spacing
TP3 = TESTPOINT: SMD test pin
U8 = STM32F103C8T6: ARM Cortex-M3 32-bit MCU, 64 KB Flash, 20 KB Internal RAM, 37 I/Os, 48-pin LQFP, -40 to 85 degC, Tray; A/D Converter: 2x12-bit (10 Channel); FLASH Size (Prog) (kB): 64; I/Os (High Current): 37; Internal RAM Size (kB): 20; Operating Frequency(F) (Processor speed) (MHz): 72; Supply Voltage(Vcc) min (V): 2; DatasheetVersion: Rev. 16; PackageVersion: Rev. 6, 06/2013; PackageReference: LQFP48; PackageDescription: 48-Pin Low Profile Quad Flat Package, 7 x 7 mm Body, 0.5 mm Pitch; Supplier 1: Digi-Key; Supplier Part Number 1: 497-6063-ND; Supplier 2: Farnell; Supplier Part Number 2: 1447637; Supplier 3: Newark; Supplier Part Number 3: 59M2182; Supplier 4: Newark; Supplier Part Number 4: 57P1222; Supplier 5: Mouser; Supplier Part Number 5: 511-STM32F103C8T6; Core: ARM Cortex-M3; Packing: Tray; Mounting Technology: Surface Mount; PartNumber: STM32F103C8T6; ComponentLink1Description: Manufacturer URL; ComponentLink1URL: http://www.st.com/web/en/home.html; ComponentLink2Description: Datasheet; ComponentLink2URL: http://www.st.com/st-web-ui/static/active/en/resource/technical/document/datasheet/CD00161566.pdf; ComponentLink3Description: Package Specification; ComponentLink3URL: http://www.st.com/st-web-ui/static/active/en/resource/technical/document/datasheet/DM00058181.pdf
Y3 = HC49/4H_SMX: as Y1 on sheet DSPpanel_v2; Published: 17-Jul-2002; DatasheetDocument: 18-Oct-1999; PackageDocument: 18-Oct-1999; PackageReference: HC49/4H_SMX; Publisher: Altium Limited; ComponentLink1Description: Manufacturer Link; ComponentLink1URL: http://www.cmac.com/mt/; ComponentLink2Description: Datasheet; ComponentLink2URL: http://www.cmac.com/mt/databook/crystals/smd/hc49_4h_smx.pdf

## Nets that join several sheets
AGND: audioCodec (20 pins), tapegyseg (C41.1 NT1.2)
AVCC: audioCodec (9 pins), tapegyseg (C41.2 L1.2)
GND: DSPpanel_v2 (44 pins), audioCodec (C8.2 C9.2 U1.14 U1.28), tapegyseg (16 pins), stlink (16 pins)
VCC: DSPpanel_v2 (J6.1 J7.3), tapegyseg (8 pins)
VDD: DSPpanel_v2 (29 pins), audioCodec (5 pins), tapegyseg (C39.2 R38.1 U5.2 U5.4), stlink (13 pins)
NetC36_1: DSPpanel_v2 (P4.8), tapegyseg (6 pins)
NetD1_A: DSPpanel_v2 (U6.38), audioCodec (D1.A D2.A)
NetF1_1: DSPpanel_v2 (J12.1), tapegyseg (F1.1 J4.1)
NetJ4_2: tapegyseg (J4.2), stlink (U8.32)
NetJ4_3: tapegyseg (J4.3), stlink (R41.1 U8.33)
NetJ10_1: DSPpanel_v2 (J10.1), stlink (U8.31)
NetJ13_2: DSPpanel_v2 (J13.2), stlink (P1.2 U8.26)
NetJ14_2: DSPpanel_v2 (J14.2), stlink (P1.3 R66.1 U8.27)
NetP4_3: DSPpanel_v2 (P4.3 P7.5 S1.1 U6.7), tapegyseg (R38.2)
NetR54_1: DSPpanel_v2 (R54.1 U6.62 U7.5), audioCodec (U1.1)
NetR55_1: DSPpanel_v2 (R55.1 U6.61 U7.6), audioCodec (U1.2)
NetU1_5: DSPpanel_v2 (U6.33), audioCodec (U1.5 U1.9)
NetU1_6: DSPpanel_v2 (U6.34), audioCodec (U1.6 U1.10)
NetU1_7: DSPpanel_v2 (U6.37), audioCodec (U1.7 U1.11)
NetU1_8: DSPpanel_v2 (U6.35), audioCodec (U1.8)
NetU1_12: DSPpanel_v2 (U6.36), audioCodec (U1.12)